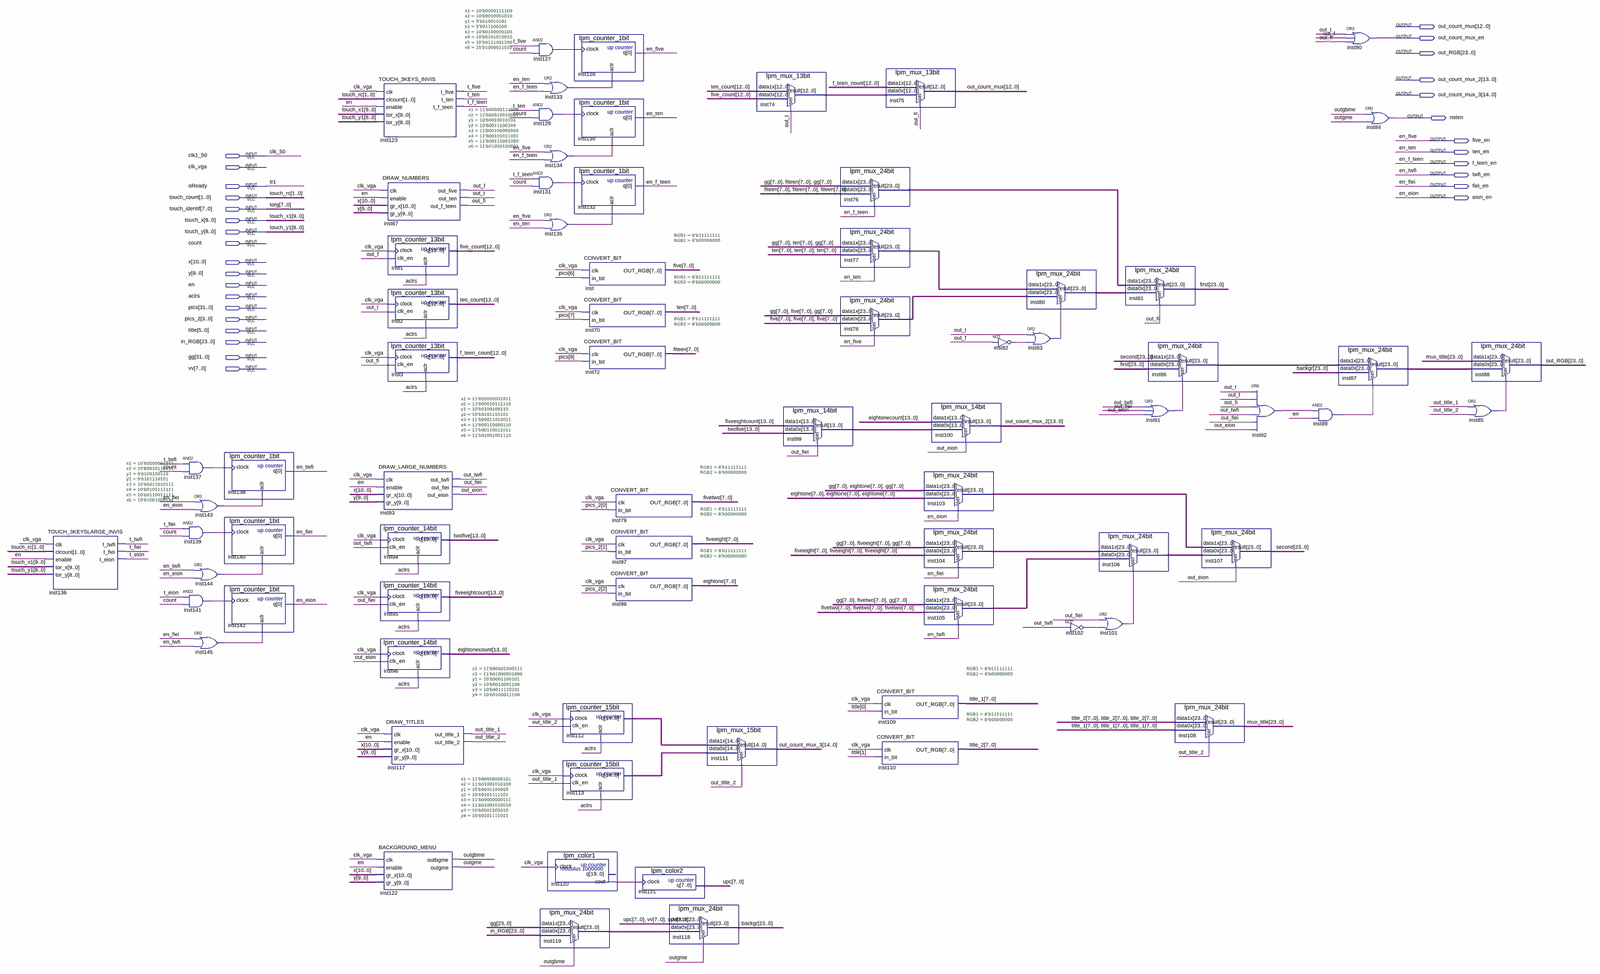
[diagram p0: schematic sheet, whole]
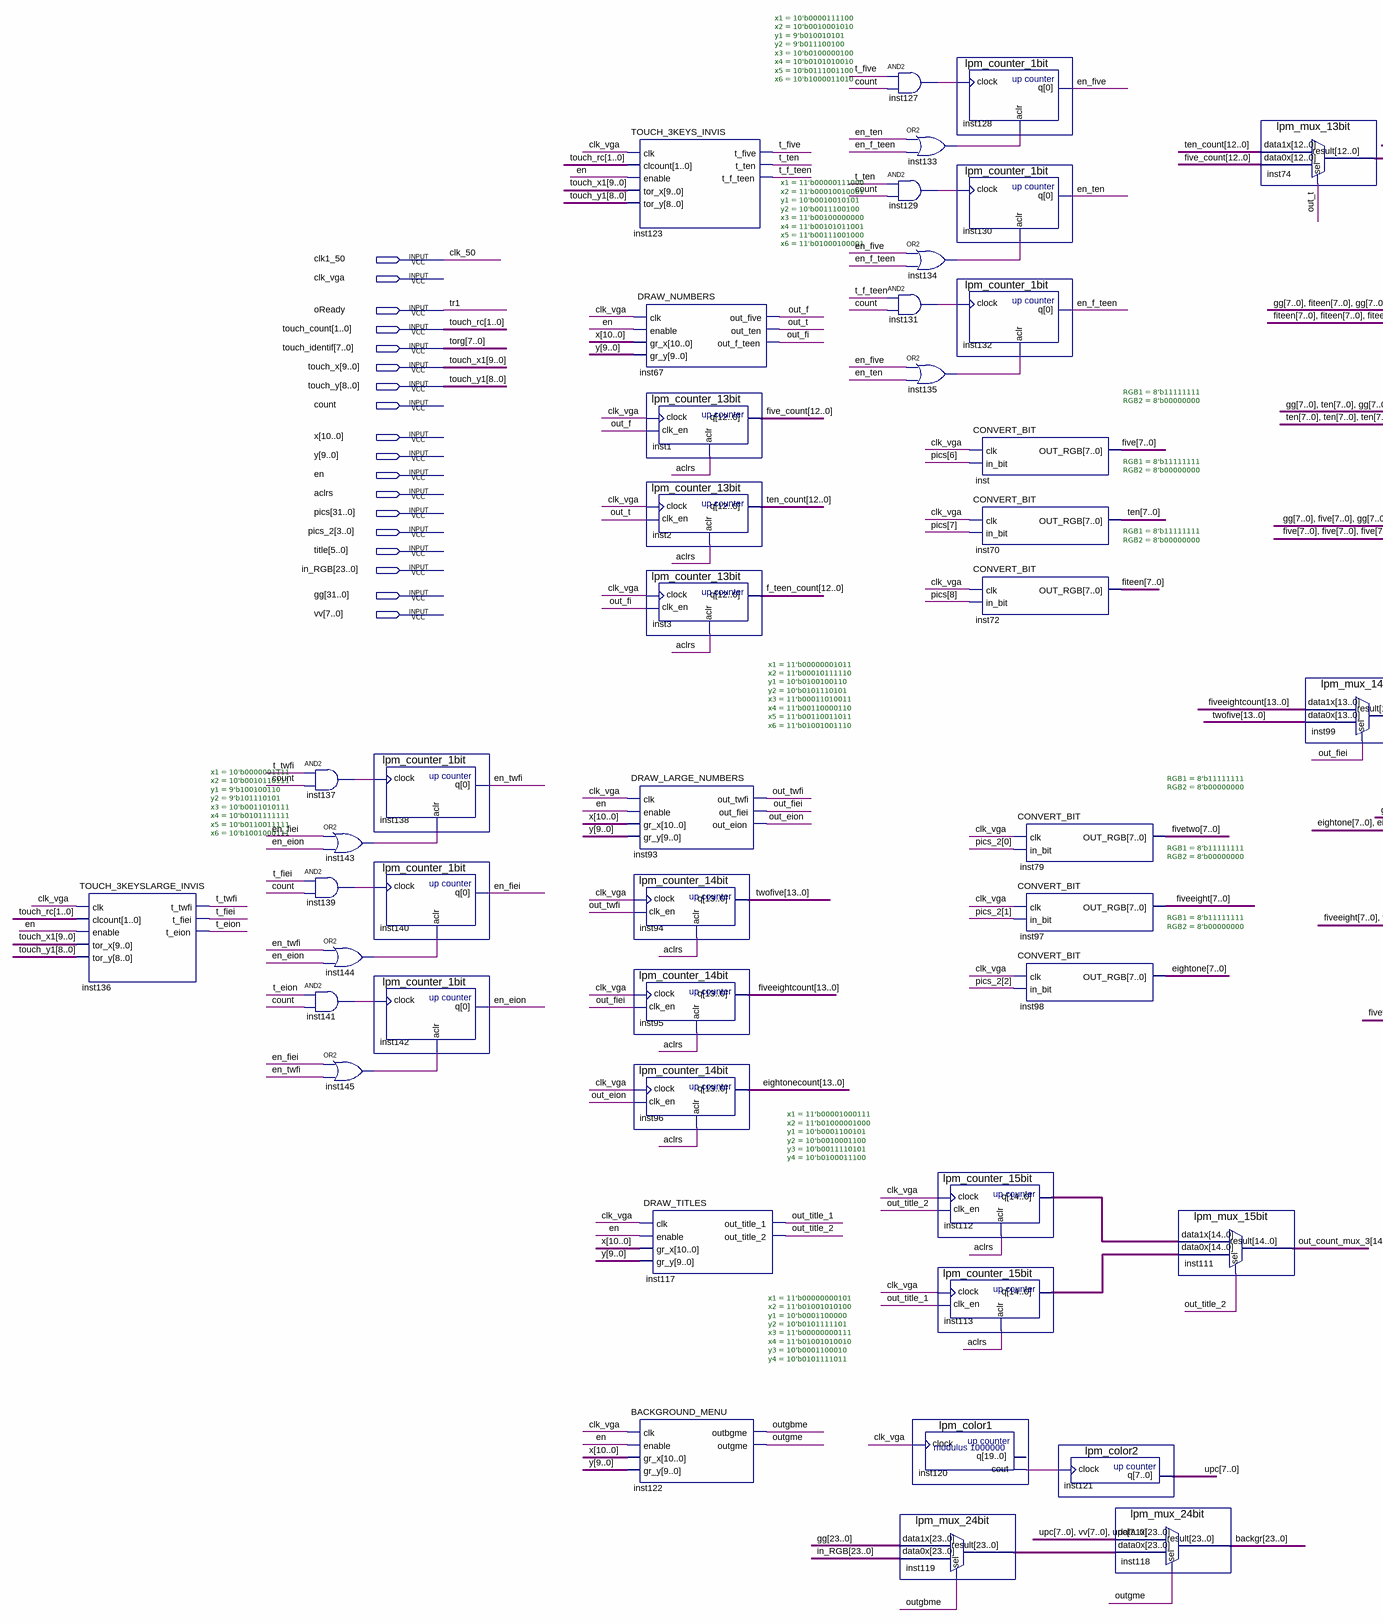
[diagram p1: schematic sheet, left part]
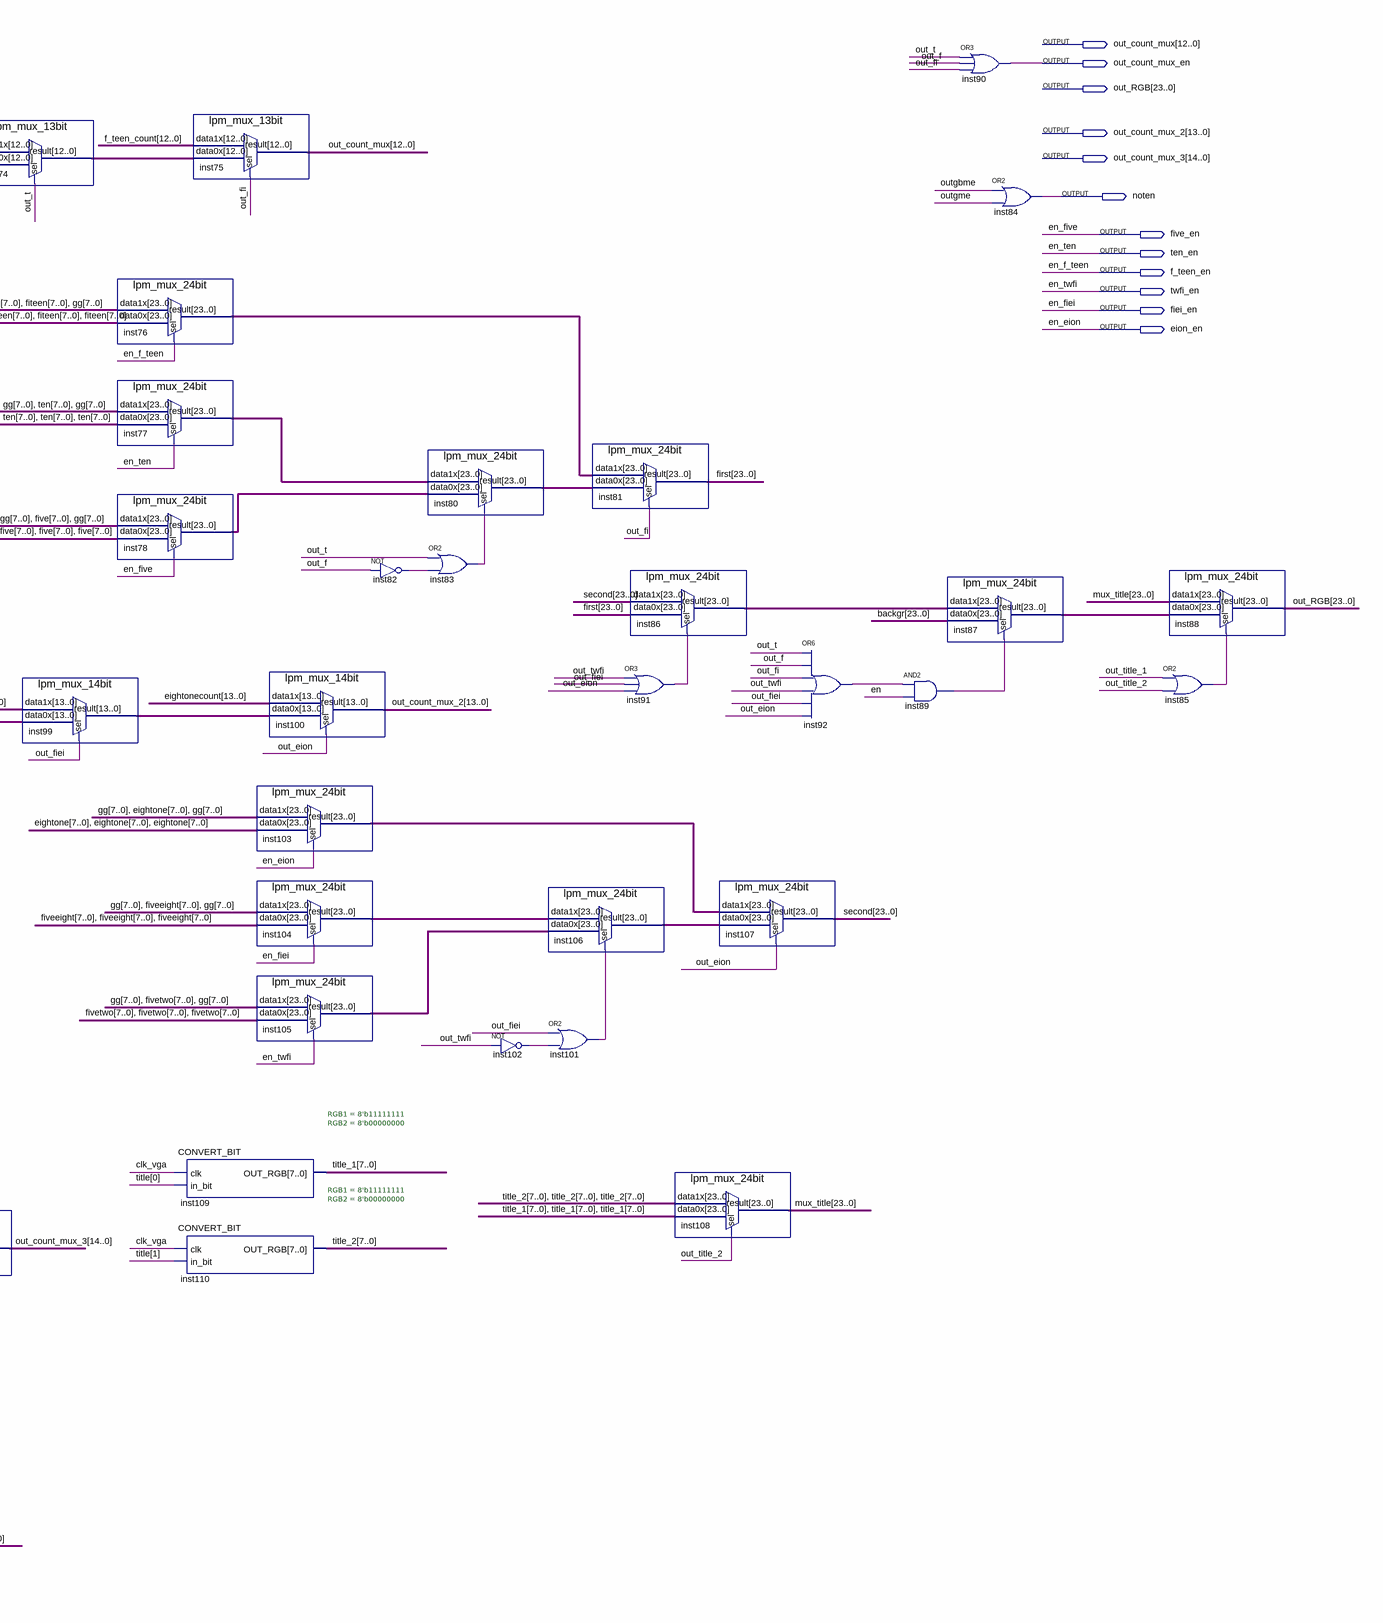
[diagram p2: schematic sheet, right part]
// Quartus schematic final_invis_keys.bdf as structural Verilog: 73 symbols, 30 pins
module final_invis_keys (
  input  clk1_50,
  input  clk_vga,
  input  oReady,
  input  [1:0] touch_count,
  input  [7:0] touch_identif,
  input  [9:0] touch_x,
  input  [8:0] touch_y,
  input  count,
  input  [10:0] x,
  input  [9:0] y,
  input  en,
  input  aclrs,
  input  [31:0] pics,
  input  [3:0] pics_2,
  input  [5:0] title,
  input  [23:0] in_RGB,
  input  [31:0] gg,
  input  [7:0] vv,
  output [12:0] out_count_mux,
  output out_count_mux_en,
  output [23:0] out_RGB,
  output [13:0] out_count_mux_2,
  output [14:0] out_count_mux_3,
  output noten,
  output five_en,
  output ten_en,
  output f_teen_en,
  output twfi_en,
  output fiei_en,
  output eion_en
);

  wire inst82_out, inst83_out, inst85_out, inst89_out, inst91_out, inst92_out, inst101_out, inst102_out,
       inst120_cout, inst127_out, inst129_out, inst131_out, inst133_out, inst134_out, inst135_out,
       inst137_out, inst139_out, inst141_out, inst143_out, inst144_out, inst145_out, out_eion, out_f, out_fi,
       out_fiei, out_t, out_title_1, out_title_2, out_twfi, outgbme, outgme, t_eion, t_f_teen, t_fiei,
       t_five, t_ten, t_twfi;
  wire [7:0] eightone, fiteen, five, fiveeight, fivetwo, ten, title_1, title_2, upc;
  wire [12:0] f_teen_count, five_count, inst74_result, ten_count;
  wire [13:0] eightonecount, fiveeightcount, inst99_result, twofive;
  wire [14:0] inst112_q, inst113_q;
  wire [23:0] backgr, first, inst76_result, inst77_result, inst78_result, inst80_result, inst86_result,
       inst87_result, inst103_result, inst104_result, inst105_result, inst106_result, inst119_result,
       mux_title, second;

  TOUCH_3KEYSLARGE_INVIS #(.x1(10'b0000001111), .x2(10'b0010110111), .y1(9'b100100110), .y2(9'b101110101), .x3(10'b0011010111), .x4(10'b0101111111), .x5(10'b0110011111), .x6(10'b1001000111)) inst136 (
    .clk(clk_vga), .clcount(touch_count), .enable(en), .tor_x(touch_x), .tor_y(touch_y), .t_twfi(t_twfi),
    .t_fiei(t_fiei), .t_eion(t_eion));
  and inst137 (inst137_out, t_twfi, count);
  or inst143 (inst143_out, fiei_en, eion_en);
  and inst139 (inst139_out, t_fiei, count);
  or inst144 (inst144_out, twfi_en, eion_en);
  and inst141 (inst141_out, t_eion, count);
  or inst145 (inst145_out, fiei_en, twfi_en);
  lpm_counter_1bit inst138 (.clock(inst137_out), .aclr(inst143_out), .q(twfi_en));
  lpm_counter_1bit inst140 (.clock(inst139_out), .aclr(inst144_out), .q(fiei_en));
  lpm_counter_1bit inst142 (.clock(inst141_out), .aclr(inst145_out), .q(eion_en));
  TOUCH_3KEYS_INVIS #(.x1(10'b0000111100), .x2(10'b0010001010), .y1(9'b010010101), .y2(9'b011100100), .x3(10'b0100000100), .x4(10'b0101010010), .x5(10'b0111001100), .x6(10'b1000011010)) inst123 (
    .clk(clk_vga), .clcount(touch_count), .enable(en), .tor_x(touch_x), .tor_y(touch_y), .t_five(t_five),
    .t_ten(t_ten), .t_f_teen(t_f_teen));
  DRAW_NUMBERS #(.x1(11'b00000111000), .x2(11'b00010010001), .y1(10'b0010010101), .y2(10'b0011100100), .x3(11'b00100000000), .x4(11'b00101011001), .x5(11'b00111001000), .x6(11'b01000100001)) inst67 (
    .clk(clk_vga), .enable(en), .gr_x(x), .gr_y(y), .out_five(out_f), .out_ten(out_t), .out_f_teen(out_fi));
  DRAW_LARGE_NUMBERS #(.x1(11'b00000001011), .x2(11'b00010111110), .y1(10'b0100100110), .y2(10'b0101110101), .x3(11'b00011010011), .x4(11'b00110000110), .x5(11'b00110011011), .x6(11'b01001001110)) inst93 (
    .clk(clk_vga), .enable(en), .gr_x(x), .gr_y(y), .out_twfi(out_twfi), .out_fiei(out_fiei),
    .out_eion(out_eion));
  lpm_counter_14bit inst94 (.clock(clk_vga), .clk_en(out_twfi), .aclr(aclrs), .q(twofive));
  lpm_counter_14bit inst95 (.clock(clk_vga), .clk_en(out_fiei), .aclr(aclrs), .q(fiveeightcount));
  lpm_counter_14bit inst96 (.clock(clk_vga), .clk_en(out_eion), .aclr(aclrs), .q(eightonecount));
  DRAW_TITLES #(.x1(11'b00001000111), .x2(11'b01000001000), .y1(10'b0001100101), .y2(10'b0010001100), .y3(10'b0011110101), .y4(10'b0100011100)) inst117 (
    .clk(clk_vga), .enable(en), .gr_x(x), .gr_y(y), .out_title_1(out_title_1), .out_title_2(out_title_2));
  BACKGROUND_MENU #(.x1(11'b00000000101), .x2(11'b01001010100), .y1(10'b0001100000), .y2(10'b0101111101), .x3(11'b00000000111), .x4(11'b01001010010), .y3(10'b0001100010), .y4(10'b0101111011)) inst122 (
    .clk(clk_vga), .enable(en), .gr_x(x), .gr_y(y), .outbgme(outgbme), .outgme(outgme));
  lpm_counter_13bit inst1 (.clock(clk_vga), .clk_en(out_f), .aclr(aclrs), .q(five_count));
  lpm_counter_13bit inst2 (.clock(clk_vga), .clk_en(out_t), .aclr(aclrs), .q(ten_count));
  lpm_counter_13bit inst3 (.clock(clk_vga), .clk_en(out_fi), .aclr(aclrs), .q(f_teen_count));
  and inst127 (inst127_out, t_five, count);
  and inst129 (inst129_out, t_ten, count);
  and inst131 (inst131_out, t_f_teen, count);
  or inst133 (inst133_out, ten_en, f_teen_en);
  or inst134 (inst134_out, five_en, f_teen_en);
  or inst135 (inst135_out, five_en, ten_en);
  lpm_counter_15bit inst112 (.clock(clk_vga), .clk_en(out_title_2), .aclr(aclrs), .q(inst112_q));
  lpm_counter_15bit inst113 (.clock(clk_vga), .clk_en(out_title_1), .aclr(aclrs), .q(inst113_q));
  lpm_color1 inst120 (.clock(clk_vga), .cout(inst120_cout));  // open: q
  lpm_mux_24bit inst119 (.data1x(gg[23:0]), .data0x(in_RGB), .sel(outgbme), .result(inst119_result));
  lpm_counter_1bit inst128 (.clock(inst127_out), .aclr(inst133_out), .q(five_en));
  lpm_counter_1bit inst130 (.clock(inst129_out), .aclr(inst134_out), .q(ten_en));
  lpm_counter_1bit inst132 (.clock(inst131_out), .aclr(inst135_out), .q(f_teen_en));
  CONVERT_BIT #(.RGB1(8'b11111111), .RGB2(8'b00000000)) inst (.clk(clk_vga), .in_bit(pics[6]), .OUT_RGB(five));
  CONVERT_BIT #(.RGB1(8'b11111111), .RGB2(8'b00000000)) inst70 (.clk(clk_vga), .in_bit(pics[7]), .OUT_RGB(ten));
  CONVERT_BIT #(.RGB1(8'b11111111), .RGB2(8'b00000000)) inst72 (.clk(clk_vga), .in_bit(pics[8]), .OUT_RGB(fiteen));
  CONVERT_BIT #(.RGB1(8'b11111111), .RGB2(8'b00000000)) inst79 (.clk(clk_vga), .in_bit(pics_2[0]), .OUT_RGB(fivetwo));
  CONVERT_BIT #(.RGB1(8'b11111111), .RGB2(8'b00000000)) inst97 (.clk(clk_vga), .in_bit(pics_2[1]), .OUT_RGB(fiveeight));
  CONVERT_BIT #(.RGB1(8'b11111111), .RGB2(8'b00000000)) inst98 (.clk(clk_vga), .in_bit(pics_2[2]), .OUT_RGB(eightone));
  lpm_color2 inst121 (.clock(inst120_cout), .q(upc));
  lpm_mux_24bit inst118 (.data1x({upc, vv, upc}), .data0x(inst119_result), .sel(outgme), .result(backgr));
  lpm_mux_15bit inst111 (.data1x(inst112_q), .data0x(inst113_q), .sel(out_title_2), .result(out_count_mux_3));
  lpm_mux_13bit inst74 (.data1x(ten_count), .data0x(five_count), .sel(out_t), .result(inst74_result));
  lpm_mux_14bit inst99 (.data1x(fiveeightcount), .data0x(twofive), .sel(out_fiei), .result(inst99_result));
  lpm_mux_24bit inst76 (
    .data1x({gg[7:0], fiteen, gg[7:0]}), .data0x({fiteen, fiteen, fiteen}), .sel(f_teen_en),
    .result(inst76_result));
  lpm_mux_24bit inst77 (
    .data1x({gg[7:0], ten, gg[7:0]}), .data0x({ten, ten, ten}), .sel(ten_en), .result(inst77_result));
  lpm_mux_24bit inst78 (
    .data1x({gg[7:0], five, gg[7:0]}), .data0x({five, five, five}), .sel(five_en), .result(inst78_result));
  lpm_mux_13bit inst75 (.data1x(f_teen_count), .data0x(inst74_result), .sel(out_fi), .result(out_count_mux));
  CONVERT_BIT #(.RGB1(8'b11111111), .RGB2(8'b00000000)) inst109 (.clk(clk_vga), .in_bit(title[0]), .OUT_RGB(title_1));
  CONVERT_BIT #(.RGB1(8'b11111111), .RGB2(8'b00000000)) inst110 (.clk(clk_vga), .in_bit(title[1]), .OUT_RGB(title_2));
  lpm_mux_14bit inst100 (.data1x(eightonecount), .data0x(inst99_result), .sel(out_eion), .result(out_count_mux_2));
  lpm_mux_24bit inst103 (
    .data1x({gg[7:0], eightone, gg[7:0]}), .data0x({eightone, eightone, eightone}), .sel(eion_en),
    .result(inst103_result));
  lpm_mux_24bit inst104 (
    .data1x({gg[7:0], fiveeight, gg[7:0]}), .data0x({fiveeight, fiveeight, fiveeight}), .sel(fiei_en),
    .result(inst104_result));
  lpm_mux_24bit inst105 (
    .data1x({gg[7:0], fivetwo, gg[7:0]}), .data0x({fivetwo, fivetwo, fivetwo}), .sel(twfi_en),
    .result(inst105_result));
  not inst82 (inst82_out, out_f);
  lpm_mux_24bit inst80 (.data1x(inst77_result), .data0x(inst78_result), .sel(inst83_out), .result(inst80_result));
  or inst83 (inst83_out, out_t, inst82_out);
  not inst102 (inst102_out, out_twfi);
  lpm_mux_24bit inst106 (.data1x(inst104_result), .data0x(inst105_result), .sel(inst101_out), .result(inst106_result));
  or inst101 (inst101_out, out_fiei, inst102_out);
  lpm_mux_24bit inst81 (.data1x(inst76_result), .data0x(inst80_result), .sel(out_fi), .result(first));
  or inst91 (inst91_out, out_twfi, out_fiei, out_eion);
  lpm_mux_24bit inst86 (.data1x(second), .data0x(first), .sel(inst91_out), .result(inst86_result));
  lpm_mux_24bit inst108 (
    .data1x({title_2, title_2, title_2}), .data0x({title_1, title_1, title_1}), .sel(out_title_2),
    .result(mux_title));
  lpm_mux_24bit inst107 (.data1x(inst103_result), .data0x(inst106_result), .sel(out_eion), .result(second));
  or inst92 (inst92_out, out_t, out_f, out_fi, out_twfi, out_fiei, out_eion);
  and inst89 (inst89_out, inst92_out, en);
  or inst90 (out_count_mux_en, out_t, out_f, out_fi);
  lpm_mux_24bit inst87 (.data1x(inst86_result), .data0x(backgr), .sel(inst89_out), .result(inst87_result));
  or inst84 (noten, outgbme, outgme);
  lpm_mux_24bit inst88 (.data1x(mux_title), .data0x(inst87_result), .sel(inst85_out), .result(out_RGB));
  or inst85 (inst85_out, out_title_1, out_title_2);

  // Other names for the same wires on the sheet: clk_50 = clk1_50; en_eion = eion_en; en_f_teen = f_teen_en;
  //   en_fiei = fiei_en; en_five = five_en; en_ten = ten_en; en_twfi = twfi_en; torg[7:0] = touch_identif;
  //   touch_rc[1:0] = touch_count; touch_x1[9:0] = touch_x; touch_y1[8:0] = touch_y; tr1 = oReady
endmodule
